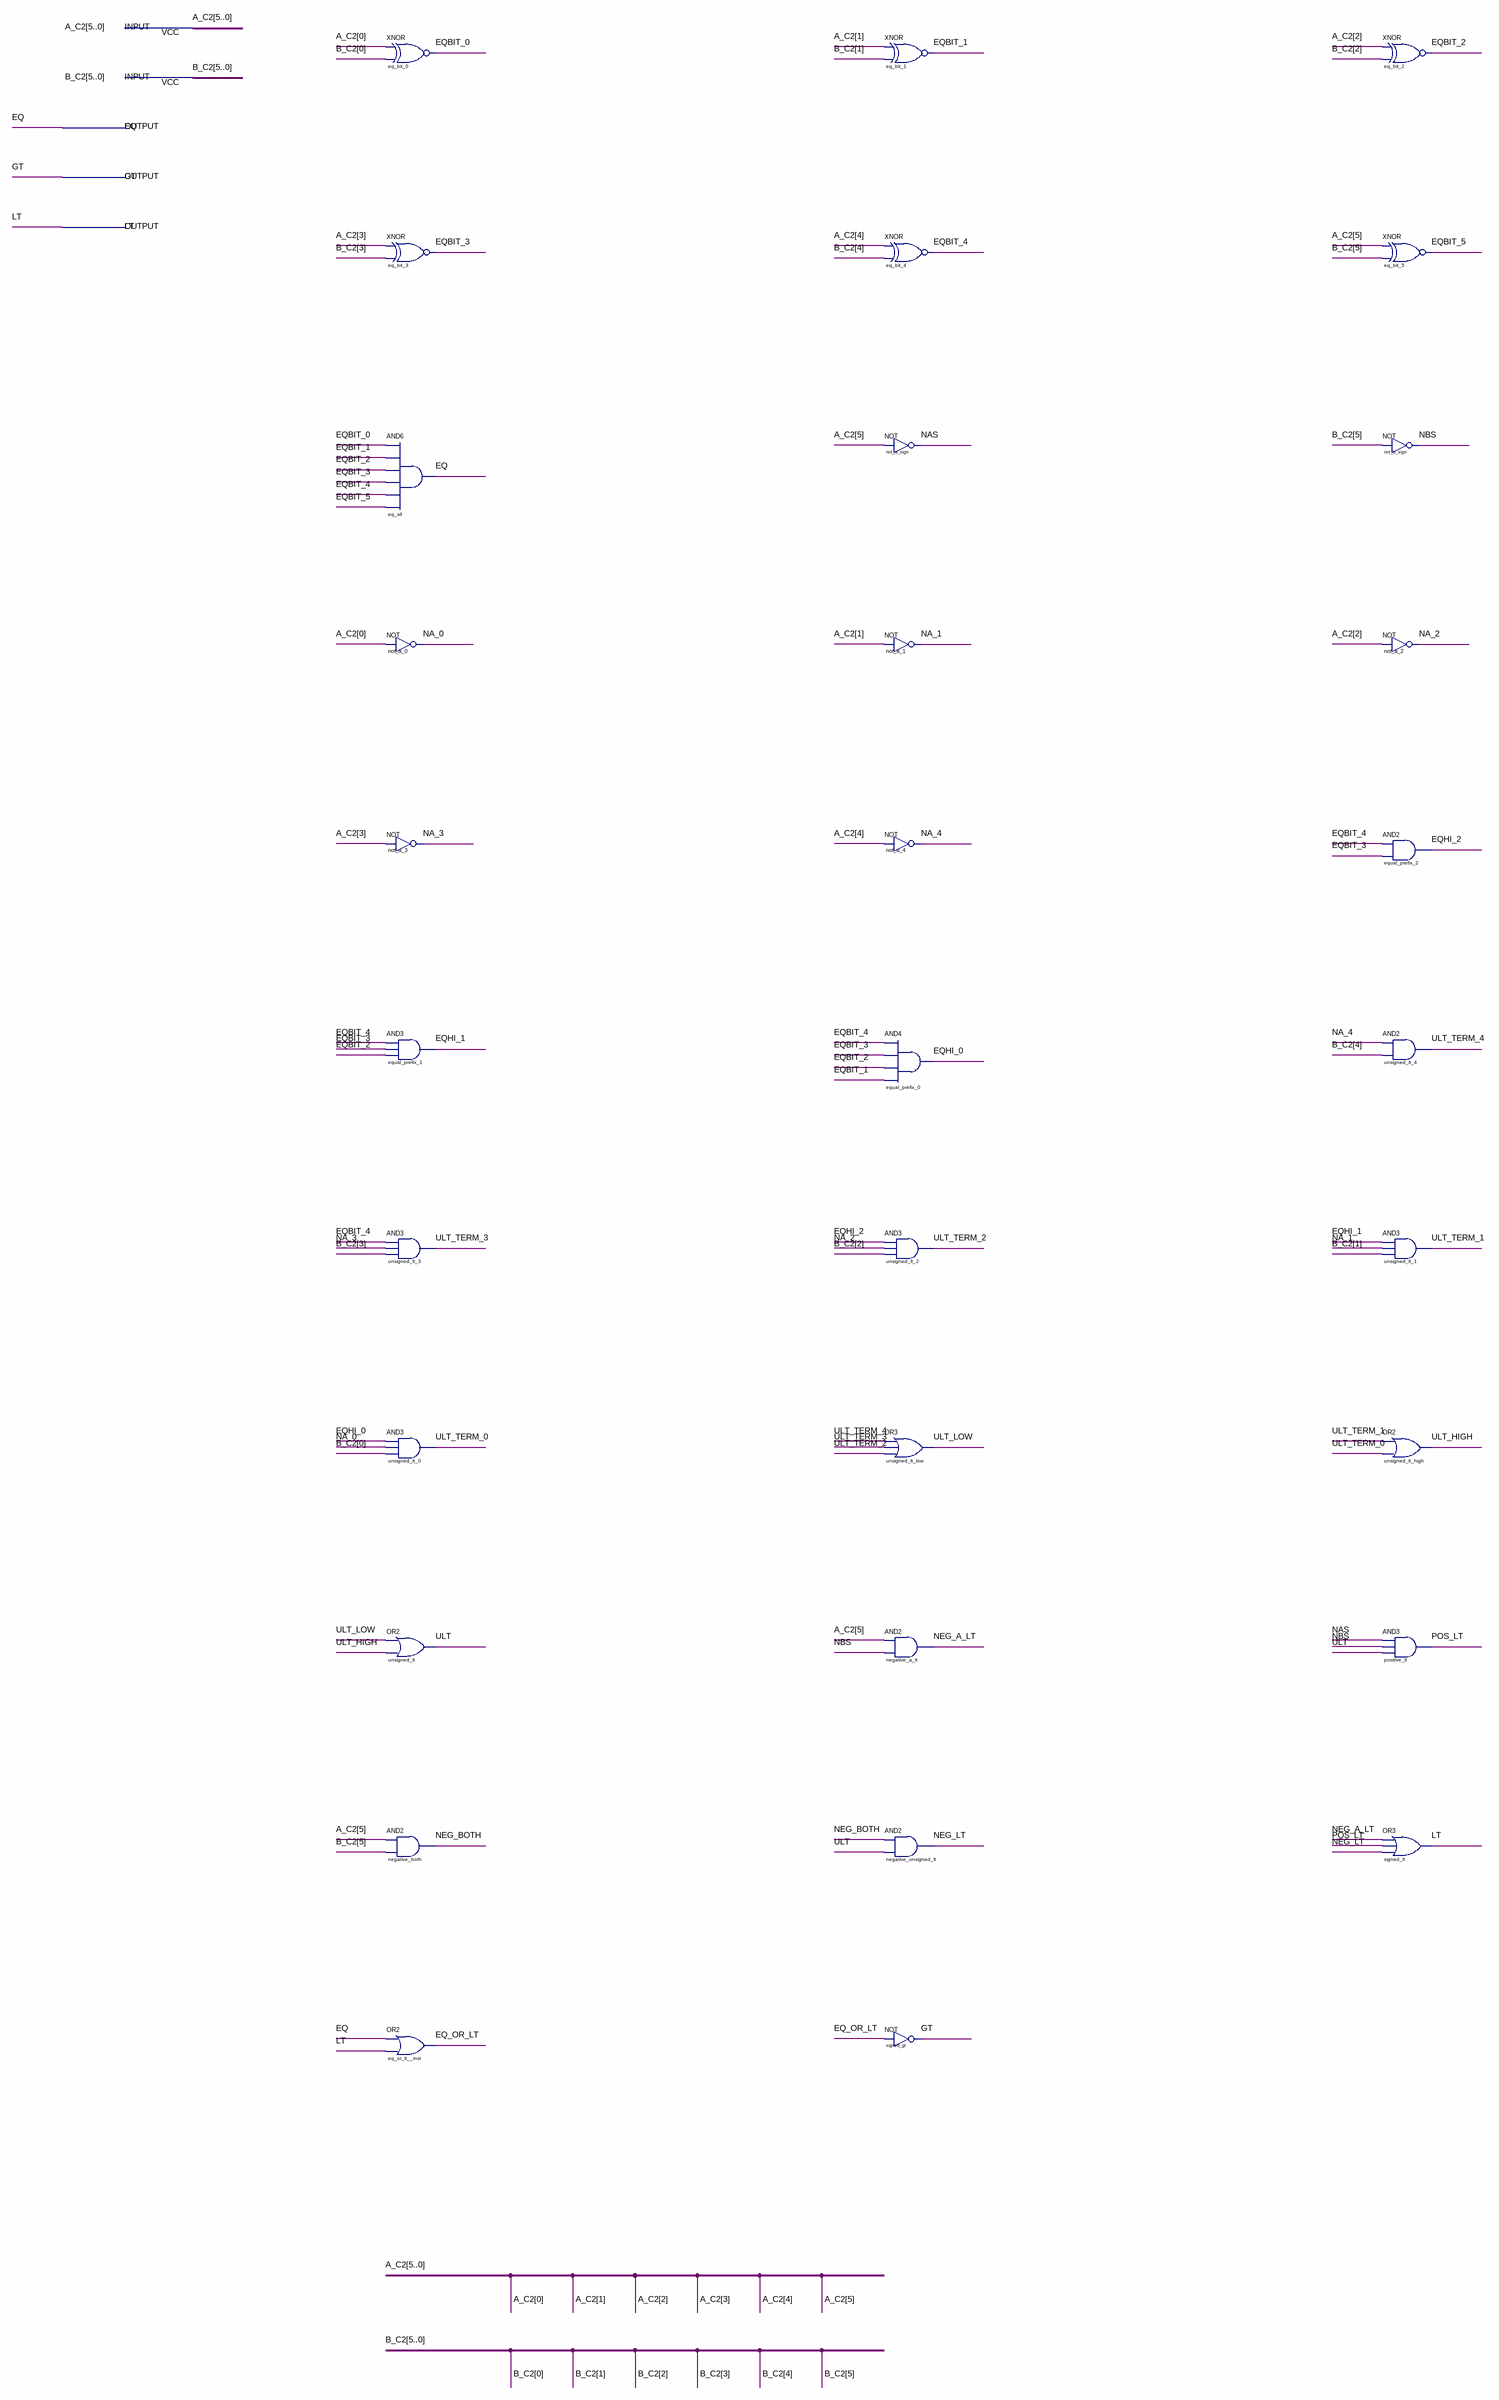
[diagram p0: schematic sheet]
// Quartus schematic comparador_c2_6bit.bdf as structural Verilog: 32 symbols, 5 pins
module comparador_c2_6bit (
  input  [5:0] A_C2,
  input  [5:0] B_C2,
  output EQ,
  output GT,
  output LT
);

  wire EQ_OR_LT, EQBIT_0, EQBIT_1, EQBIT_2, EQBIT_3, EQBIT_4, EQBIT_5, EQHI_0, EQHI_1, EQHI_2, NA_0, NA_1,
       NA_2, NA_3, NA_4, NAS, NBS, NEG_A_LT, NEG_BOTH, NEG_LT, POS_LT, ULT, ULT_HIGH, ULT_LOW, ULT_TERM_0,
       ULT_TERM_1, ULT_TERM_2, ULT_TERM_3, ULT_TERM_4;

  xnor eq_bit_0 (EQBIT_0, A_C2[0], B_C2[0]);
  xnor eq_bit_3 (EQBIT_3, A_C2[3], B_C2[3]);
  and eq_all (EQ, EQBIT_0, EQBIT_1, EQBIT_2, EQBIT_3, EQBIT_4, EQBIT_5);
  not not_a_0 (NA_0, A_C2[0]);
  not not_a_3 (NA_3, A_C2[3]);
  and equal_prefix_1 (EQHI_1, EQBIT_4, EQBIT_3, EQBIT_2);
  and unsigned_lt_3 (ULT_TERM_3, EQBIT_4, NA_3, B_C2[3]);
  and unsigned_lt_0 (ULT_TERM_0, EQHI_0, NA_0, B_C2[0]);
  or unsigned_lt (ULT, ULT_LOW, ULT_HIGH);
  and negative_both (NEG_BOTH, A_C2[5], B_C2[5]);
  or eq_or_lt__inst (EQ_OR_LT, EQ, LT);
  xnor eq_bit_1 (EQBIT_1, A_C2[1], B_C2[1]);
  xnor eq_bit_4 (EQBIT_4, A_C2[4], B_C2[4]);
  not not_a_sign (NAS, A_C2[5]);
  not not_a_1 (NA_1, A_C2[1]);
  not not_a_4 (NA_4, A_C2[4]);
  and equal_prefix_0 (EQHI_0, EQBIT_4, EQBIT_3, EQBIT_2, EQBIT_1);
  and unsigned_lt_2 (ULT_TERM_2, EQHI_2, NA_2, B_C2[2]);
  or unsigned_lt_low (ULT_LOW, ULT_TERM_4, ULT_TERM_3, ULT_TERM_2);
  and negative_a_lt (NEG_A_LT, A_C2[5], NBS);
  and negative_unsigned_lt (NEG_LT, NEG_BOTH, ULT);
  not signed_gt (GT, EQ_OR_LT);
  xnor eq_bit_2 (EQBIT_2, A_C2[2], B_C2[2]);
  xnor eq_bit_5 (EQBIT_5, A_C2[5], B_C2[5]);
  not not_b_sign (NBS, B_C2[5]);
  not not_a_2 (NA_2, A_C2[2]);
  and equal_prefix_2 (EQHI_2, EQBIT_4, EQBIT_3);
  and unsigned_lt_4 (ULT_TERM_4, NA_4, B_C2[4]);
  and unsigned_lt_1 (ULT_TERM_1, EQHI_1, NA_1, B_C2[1]);
  or unsigned_lt_high (ULT_HIGH, ULT_TERM_1, ULT_TERM_0);
  and positive_lt (POS_LT, NAS, NBS, ULT);
  or signed_lt (LT, NEG_A_LT, POS_LT, NEG_LT);
endmodule
